# EAGLE schematic termostato (EAGLE 7.2.0)
CDESIGNER: Apellido, Nombre; CNAME: TERMOSTATO; CREVISION: 1.0; CSCHO: ESCUELA
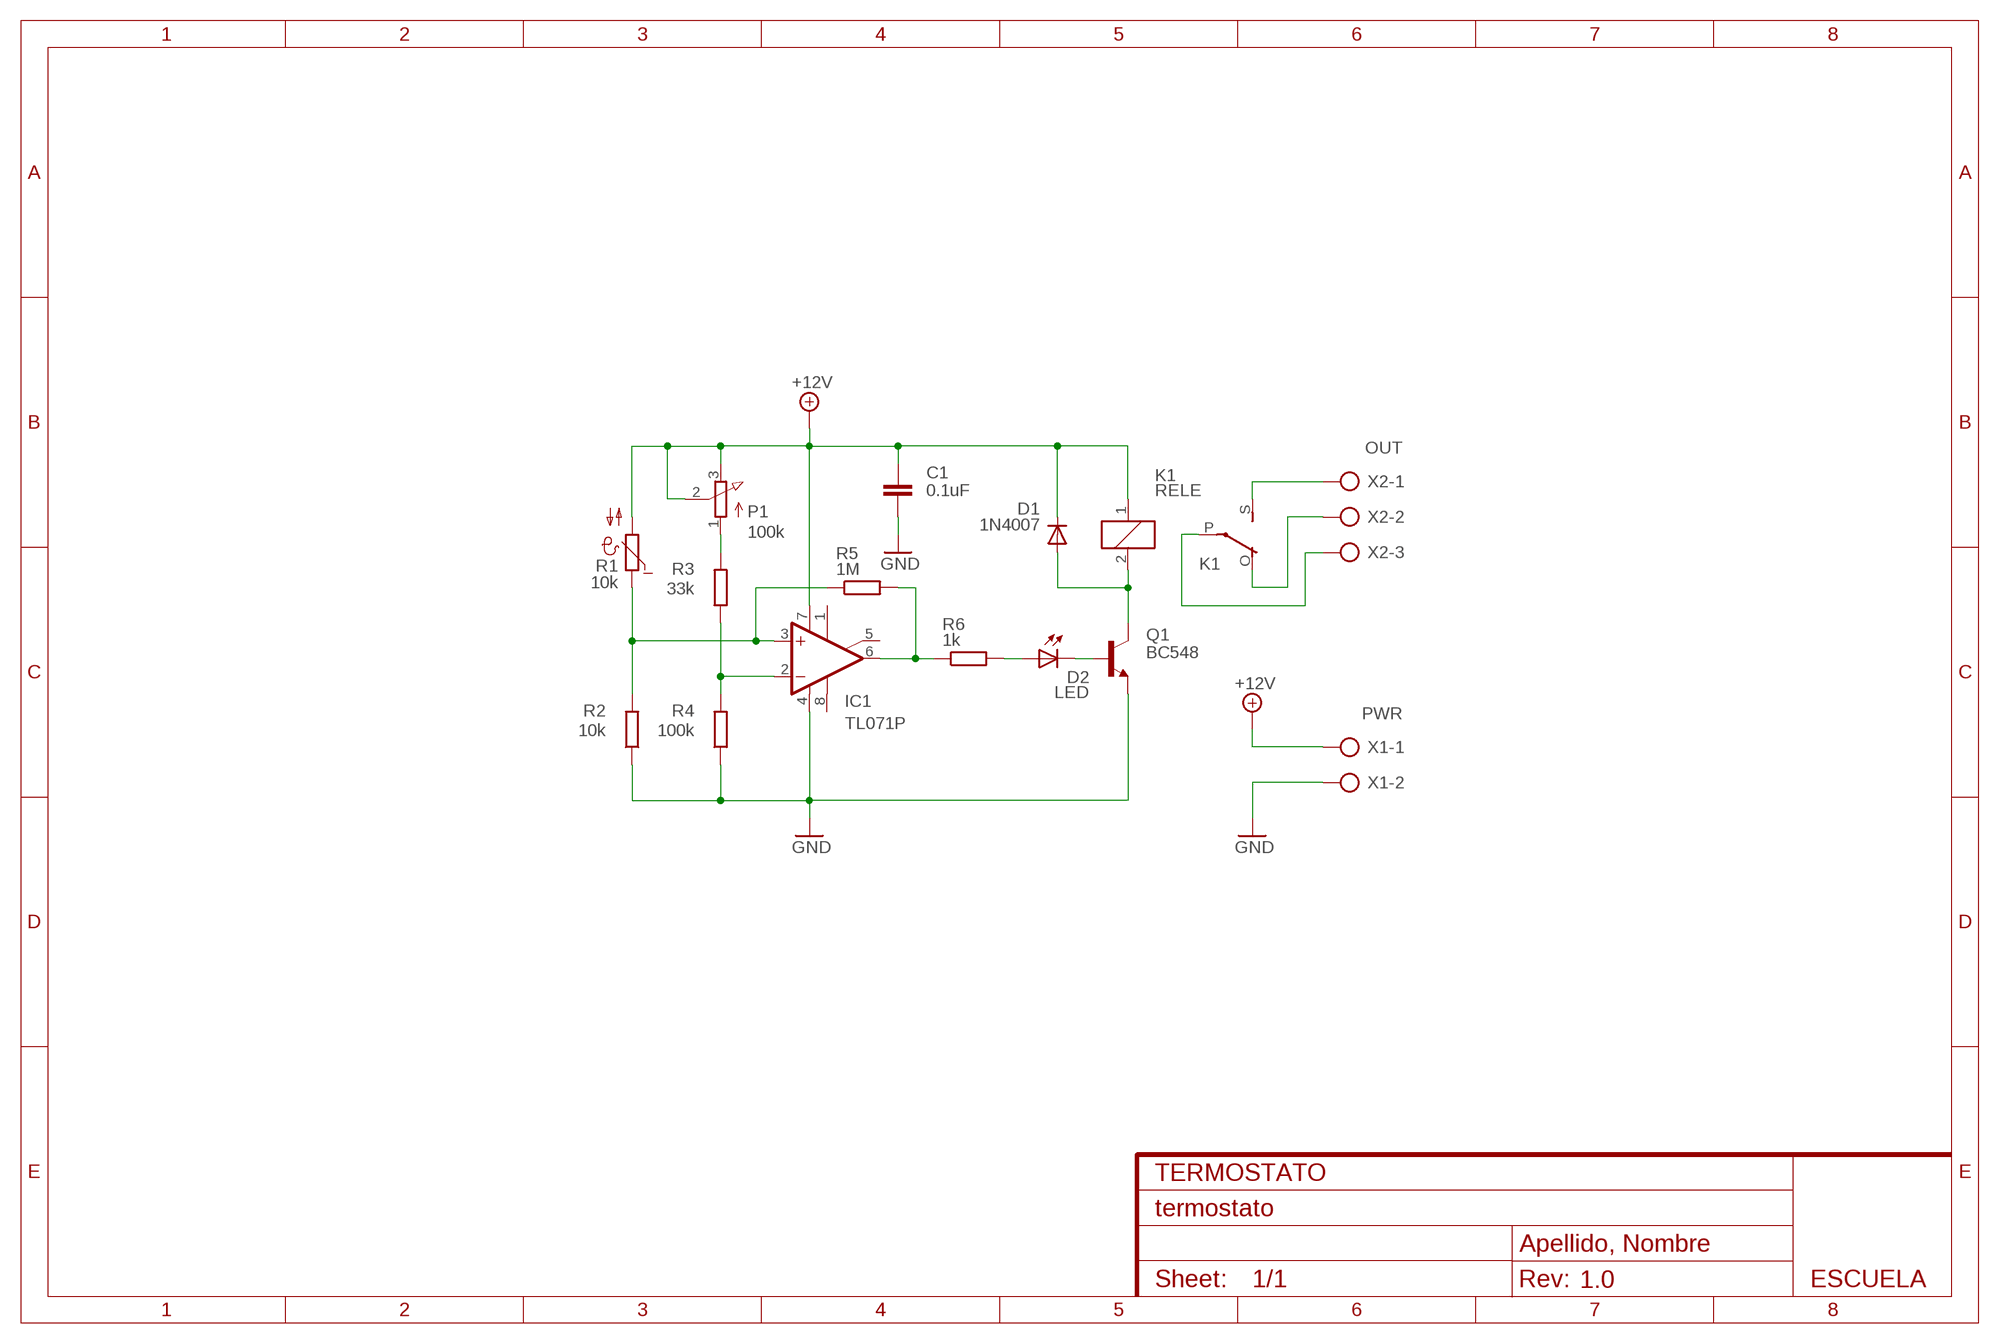
[diagram p0: schematic, sheet 1]

## Parts
C1  0.1uF  C-EU025_050-025X075  [C025_050-025X075]
D1  1N4007  [DO41-10]
D2  LED  LED3MM  [LED_3MM]
IC1  TL071P  [DIL08]
K1  RELE  RELE_G5LE  [G5LE]
P1  100k  3RP/1610N  [3RP/1610N]
Q1  BC548  [TO92-EBC]
R1  10k  NTC642-6  [P642]
R2  10k  RESISTOR-EU0204/7  [0204/7]
R3  33k  RESISTOR-EU0204/7  [0204/7]
R4  100k  RESISTOR-EU0204/7  [0204/7]
R5  1M  RESISTOR-EU0204/7  [0204/7]
R6  1k  RESISTOR-EU0204/7  [0204/7]
X1  PWR  BORNERA_AK500/2  [AK500/2]
X2  OUT  BORNERA_AK500/3  [AK500/3]

## Nets
+12V: C1.1 D1.C IC1.7(V+) K1.1 P1.2(S) P1.3(E) R1.2 X1.1
GND: C1.2 IC1.4(V-) Q1.E R2.1 R4.1 X1.2
N$1: D2.K(C) Q1.B
N$2: IC1.2(-IN) R3.1 R4.2
N$3: D2.A R6.2
N$4: P1.1(A) R3.2
N$5: K1.S(2:NA) X2.1
N$6: IC1.6(OUT) R5.2 R6.1
N$7: IC1.3(+IN) R1.1 R2.2 R5.1
N$8: K1.O(2:NC) X2.2
N$9: D1.A K1.2 Q1.C
N$10: K1.P(2:COM) X2.3
Unconnected: IC1.1(ON1) IC1.5(ON2) IC1.8(OPT)

## Library data of the parts
C1 = rcl:C-EU: CAPACITOR, European symbol
D1 = treser_lib:1N4007: Diodo Rectificador Rectificador de proposito general 1N400x.
D2 = treser_lib:LED: LEDs
IC1 = linear:TL071: OP AMP
K1 = treser_lib:RELE_G5LE: Relé Simple Inversor 1 x Switch, 10 A/120 V AC, 8 A/30 V DC, Omron.; OC_FARNELL: unknown; OC_NEWARK: unknown
P1 = pot:3RP/1610N: 16mm Potentiometer one level Source: http://www.alphapotentiometers.net/html/16mm_pot_2.html
Q1 = treser_lib:BC548: Transistor NPN
R1 = ptc-ntc:NTC642-6: PHILIPS NTC; OC_FARNELL: unknown; OC_NEWARK: unknown
R2-R6 = treser_lib:RESISTOR-EU: Resistor Simbolo europeo.
X1 = treser_lib:BORNERA_AK500/2: Bornera de tornillo; OC_FARNELL: unknown; OC_NEWARK: unknown
X2 = treser_lib:BORNERA_AK500/3: Bornera de tornillo; OC_FARNELL: unknown; OC_NEWARK: unknown